# EAGLE design DownLink.ver1 (EAGLE 9.6.2)
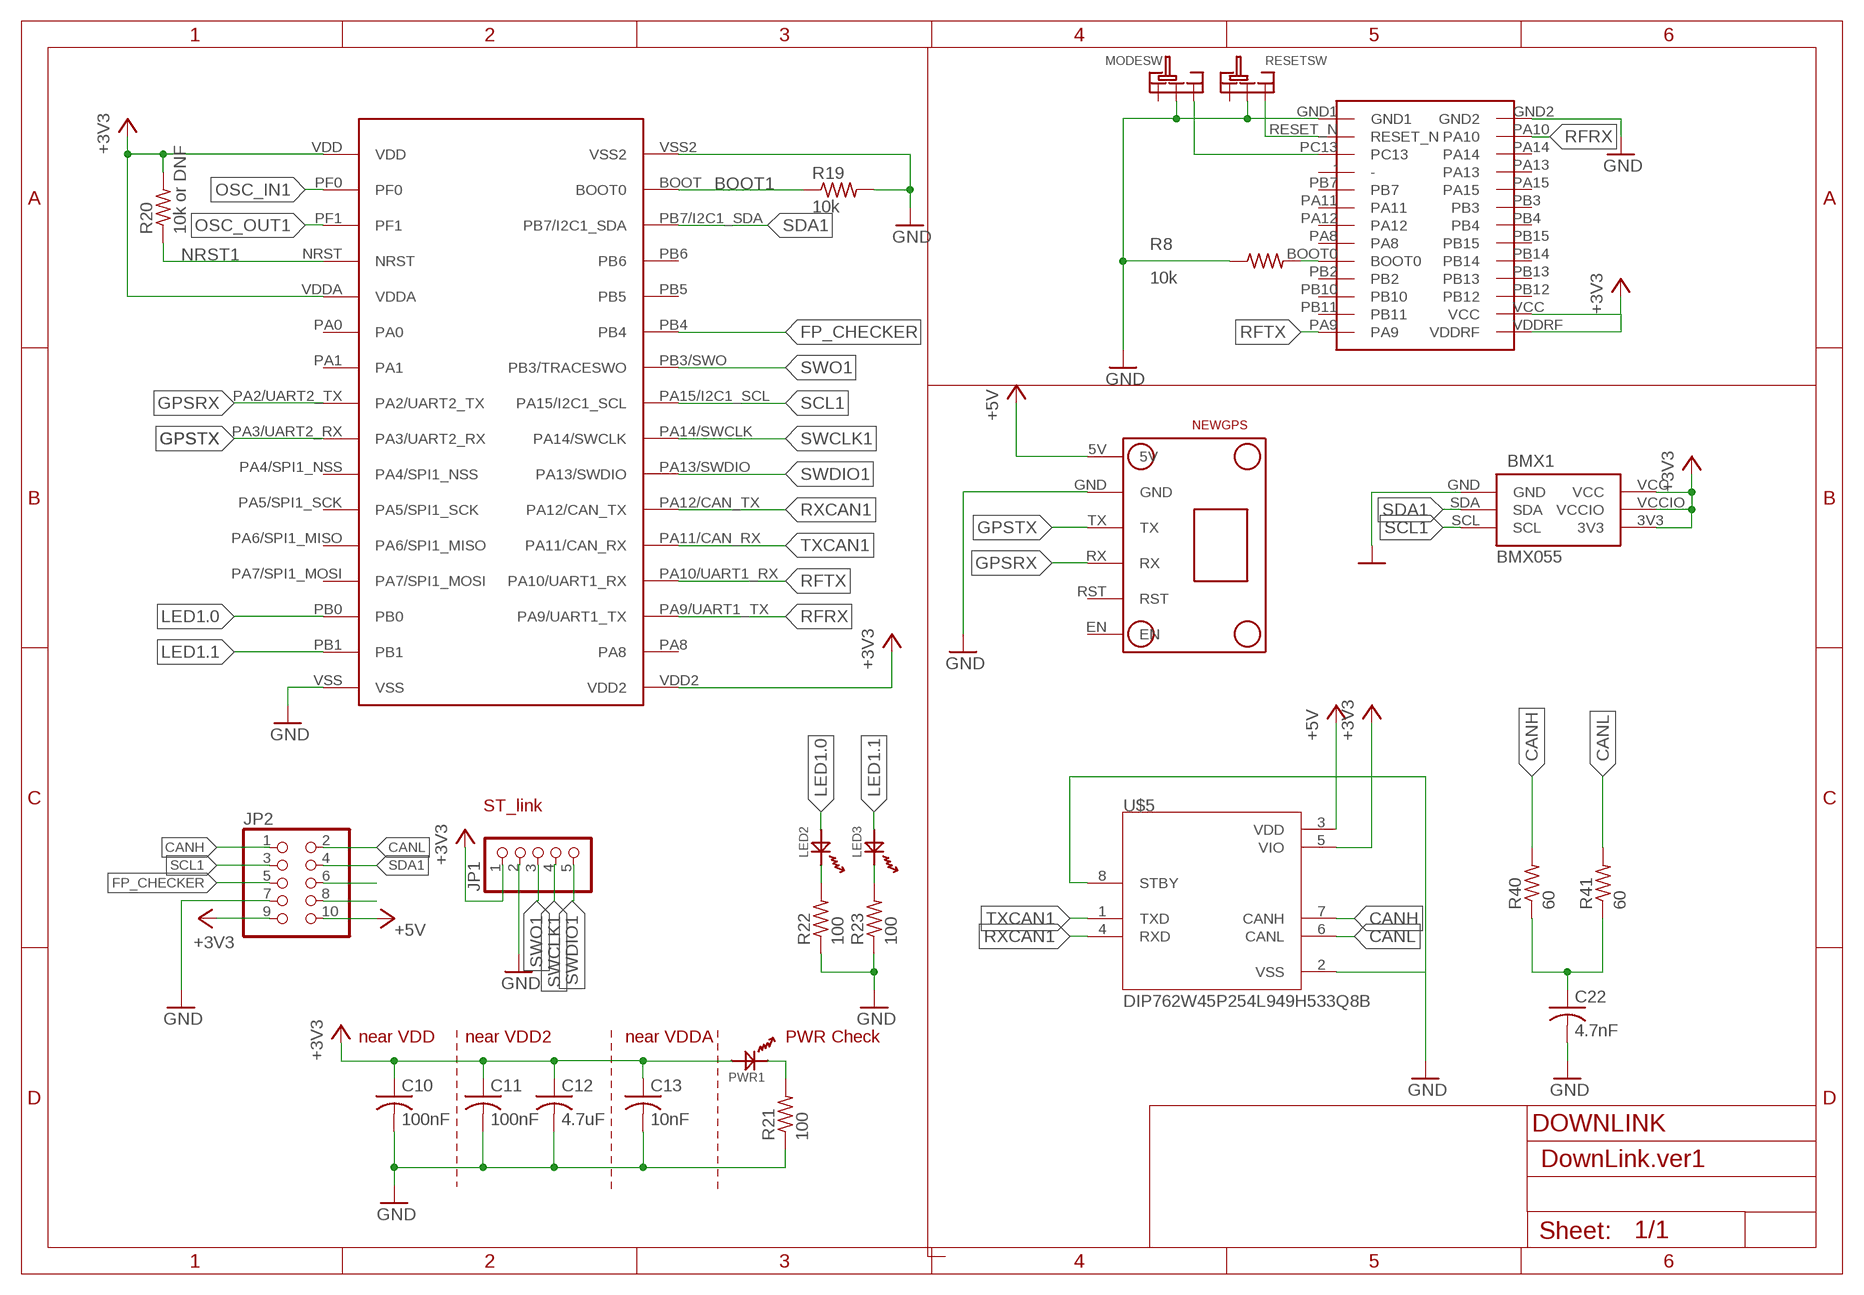
[diagram p0: schematic, sheet 1]

## Parts
BMX1  BMX055  [BMX055]
C10  100nF  C-USC1608  [C1608]
C11  100nF  C-USC1608  [C1608]
C12  4.7uF  C-USC1608  [C1608]
C13  10nF  C-USC1608  [C1608]
C22  4.7nF  C-USC0603  [C0603]
JP1  PINHD-1X5/90  [1X05/90]
JP2  PINHD-2X5/90  [2X05/90]
LED2  OSXX1608C1A  [OSXX1608C1A]
LED3  OSXX1608C1A  [OSXX1608C1A]
MODESW  SRIDE_SWITCH  [SRIDE_SWITCH]
PWR1  OSXX1608C1A  [OSXX1608C1A]
R8  10k  R-US_R0603  [R0603]
R19  10k  R-US_R0603  [R0603]
R20  10k or DNF  R-US_R0603  [R0603]
R21  100  R-US_R0603  [R0603]
R22  100  R-US_R0603  [R0603]
R23  100  R-US_R0603  [R0603]
R40  60  R-US_R0603  [R0603]
R41  60  R-US_R0603  [R0603]
RESETSW  SRIDE_SWITCH  [SRIDE_SWITCH]
STM1  STM32F303K8  [STM32F303K8]
U$1  NEWGPS  [NEWGPS]
U$3  RM-92A  [RM-92A]
U$5  DIP762W45P254L949H533Q8B  [DIP762W45P254L949H533Q8B]

## Nets
+3V3: BMX1.3V3 BMX1.VCC BMX1.VCCIO C10.1 C11.1 C12.1 C13.1 JP1.1 JP2.9 PWR1.AN R20.2 STM1.VDD STM1.VDD2 STM1.VDDA U$3.VCC U$3.VDDRF U$5.5(VIO)
+5V: JP2.10 U$1.5V U$5.3(VDD)
BOOT1: R19.1 STM1.BOOT(BOOT0)
CANH: JP2.1 R40.2 U$5.7(CANH)
CANL: JP2.2 R41.2 U$5.6(CANL)
FP_CHECKER: JP2.5 STM1.PB4
GND [im]: BMX1.GND C10.2 C11.2 C12.2 C13.2 C22.2 JP1.2 JP2.7 MODESW.LR R8.1 R19.2 R21.1 R22.1 R23.1 RESETSW.LR STM1.VSS STM1.VSS2 U$1.GND U$3.GND1 U$3.GND2 U$5.2(VSS) U$5.8(STBY)
GPSRX: STM1.PA2/UART2_TX U$1.RX
GPSTX: STM1.PA3/UART2_RX U$1.TX
LED1.0: LED2.AN STM1.PB0
LED1.1: LED3.AN STM1.PB1
N$5: MODESW.R U$3.PC13
N$6: RESETSW.R U$3.RESET_N
N$8: JP2.6
N$10: R8.2 U$3.BOOT0
N$11: JP2.8
N$15: PWR1.CT R21.2
N$16: LED2.CT R22.2
N$17: LED3.CT R23.2
N$22: C22.1 R40.1 R41.1
NRST1: R20.1 STM1.NRST
OSC_IN1: STM1.PF0
OSC_OUT1: STM1.PF1
RFRX: STM1.PA9/UART1_TX U$3.PA10
RFTX: STM1.PA10/UART1_RX U$3.PA9
RXCAN1: STM1.PA12/CAN_TX U$5.4(RXD)
SCL1: BMX1.SCL JP2.3 STM1.PA15/I2C1_SCL
SDA1: BMX1.SDA JP2.4 STM1.PB7/I2C1_SDA
SWCLK1: JP1.4 STM1.PA14/SWCLK
SWDIO1: JP1.5 STM1.PA13/SWDIO
SWO1: JP1.3 STM1.PB3/SWO(PB3/TRACESWO)
TXCAN1: STM1.PA11/CAN_RX U$5.1(TXD)
Unconnected: MODESW.L RESETSW.L STM1.PA0 STM1.PA1 STM1.PA4/SPI1_NSS STM1.PA5/SPI1_SCK STM1.PA6/SPI1_MISO STM1.PA7/SPI1_MOSI STM1.PA8 STM1.PB5 STM1.PB6 U$1.EN U$1.RST U$3.- U$3.PA8 U$3.PA11 U$3.PA12 U$3.PA13 U$3.PA14 U$3.PA15 U$3.PB2 U$3.PB3 U$3.PB4 U$3.PB7 U$3.PB10 U$3.PB11 U$3.PB12 U$3.PB13 U$3.PB14 U$3.PB15

## Notes on the sheet
- ST_link
- near VDD | near VDD2 | near VDDA | PWR Check
- DOWNLINK

## Library data of the parts
BMX1 = BMX055:BMX055
C10-C13 C22 = rcl:C-US: CAPACITOR, American symbol; SPICEPREFIX: C
JP1 = pinhead:PINHD-1X5: PIN HEADER
JP2 = pinhead:PINHD-2X5: PIN HEADER
LED2 LED3 PWR1 = Chip LED:OSXX1608C1A
MODESW RESETSW = Sride Switch:SRIDE_SWITCH
R8 R19-R23 R40 R41 = rcl:R-US_: RESISTOR, American symbol; SPICEPREFIX: R
STM1 = STM32F303K8:STM32F303K8
U$1 = New_GPS:NEWGPS
U$3 = RM-92A:RM-92A
U$5 = MCP2562-E_P:DIP762W45P254L949H533Q8B

## Net classes
0 default: width 0.279 mm

## Board
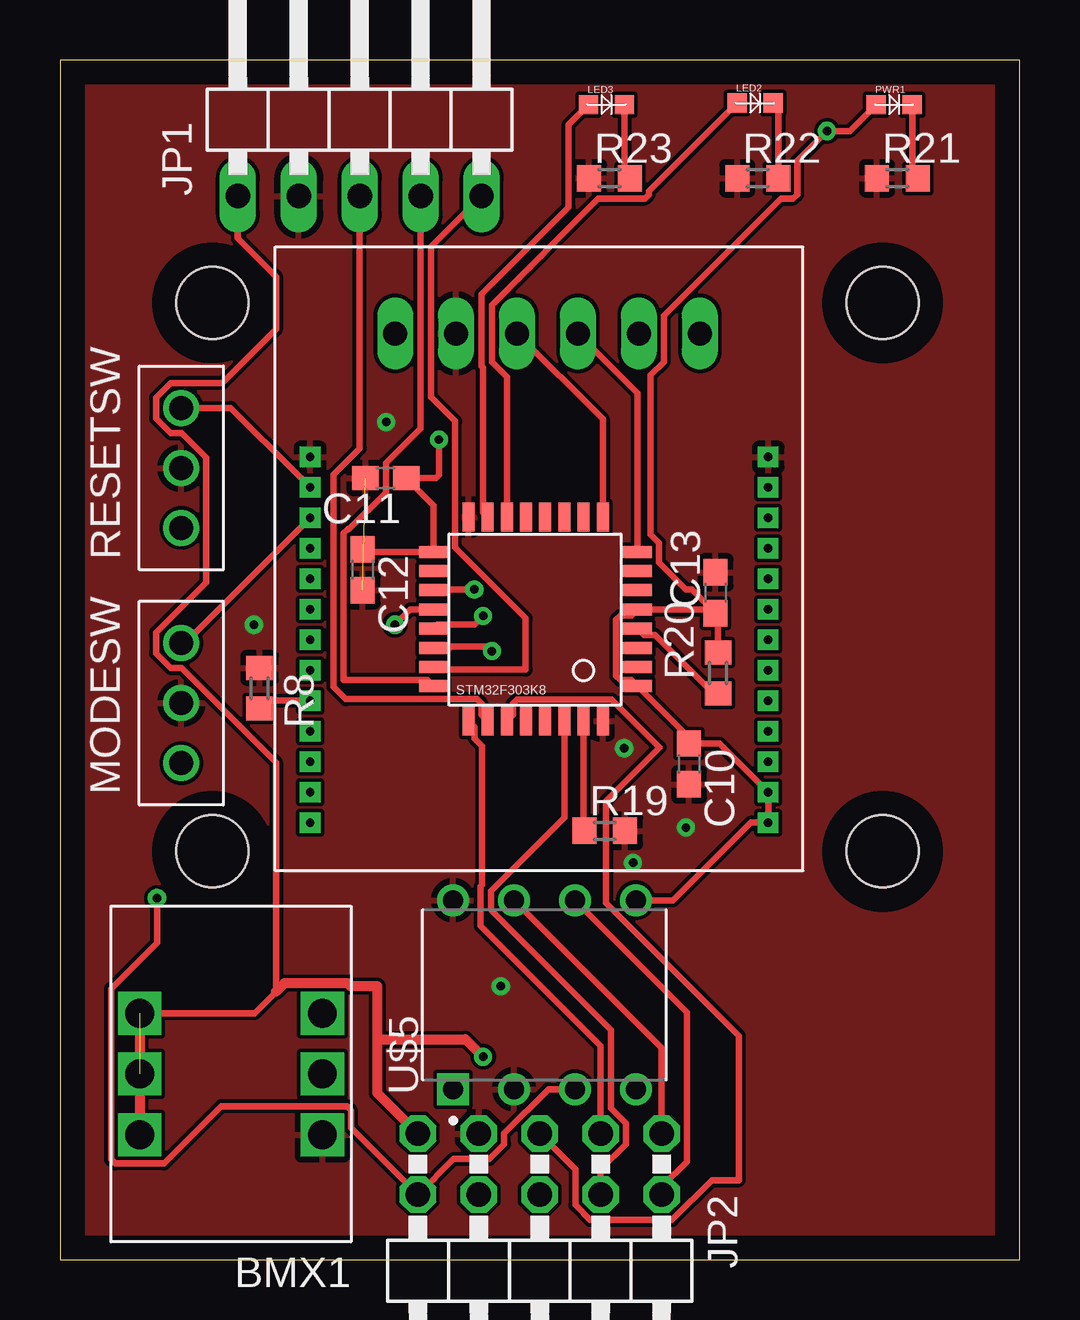
[diagram p1: board, top side]
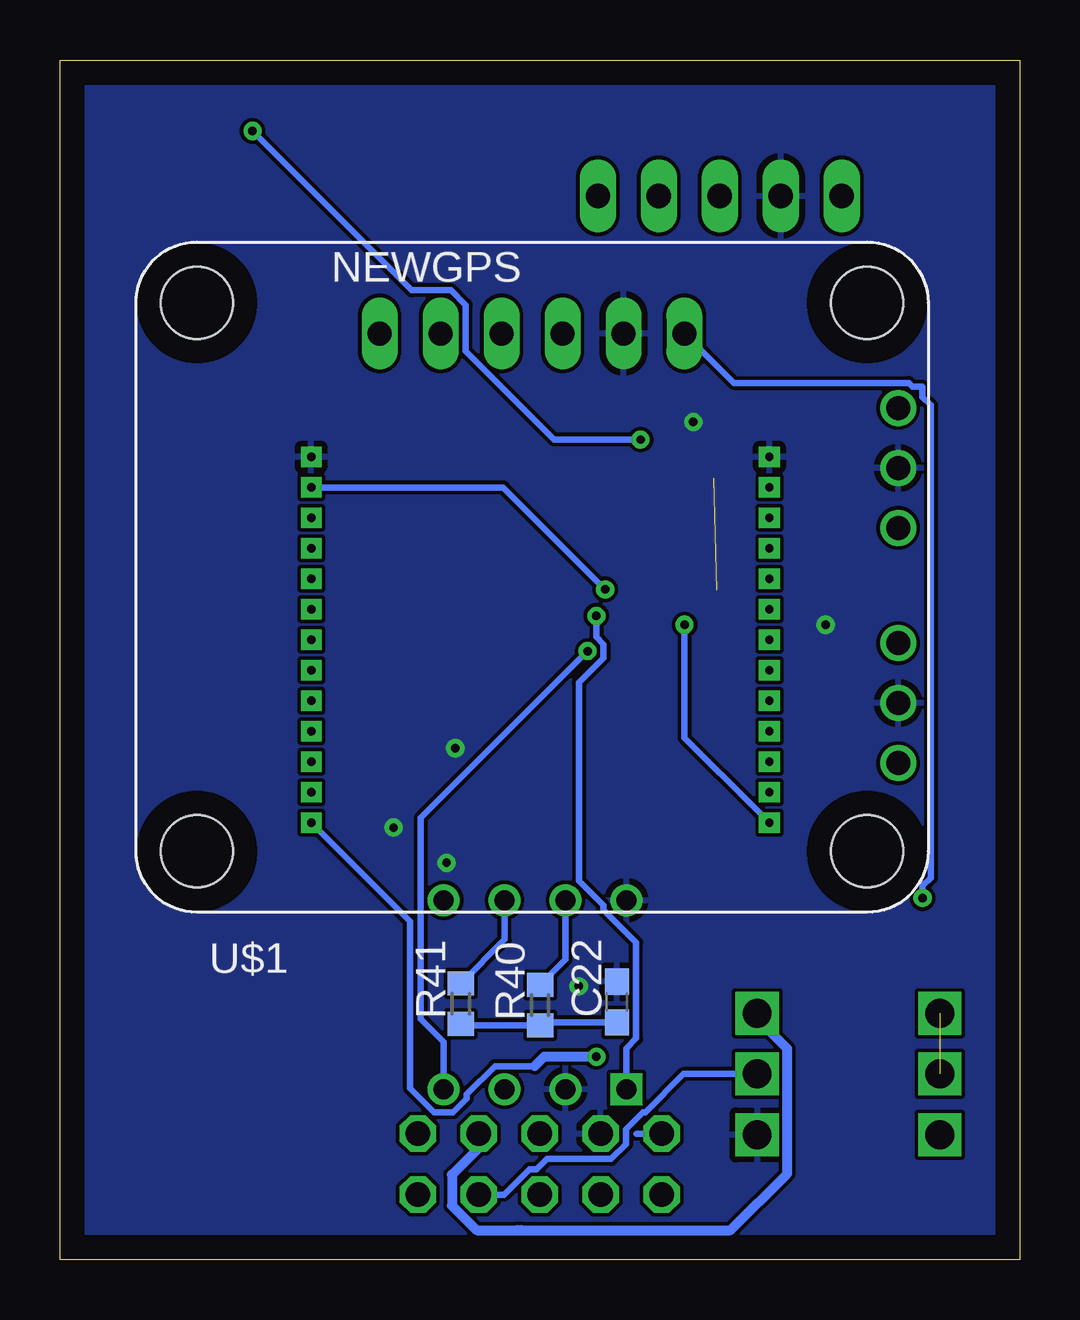
[diagram p2: board, bottom side, seen from below]

Size 40 x 50 mm. Coordinates in mm from the lower left corner, seen from the top.
Outline: 0,0 40,0 40,50 0,50 0,0
Copper layers (1*16): Top 0.035mm / dielectric 1.5mm / Bottom 0.035mm
Design rules "default": minimum track width 6mil, minimum drill 0.35mm, track to track 6mil, track to pad 6mil, pad to pad 6mil, via to via 6mil, smd to smd 6mil, copper to edge 40mil, drill to drill 6mil, minimum pad ring 10mil, minimum via ring 8mil, stop-mask expansion 4mil, vias tented up to drill 0mil, thermal gap 10mil

### Footprints (pad centres in the part's own frame; a part is rotated, then mirrored left to right if it is on the bottom)
BMX055 = drill 1.2 pad 1.5 square: 3V3 8.81,-9.53; GND 1.19,-4.46; SCL 1.19,-9.53; SDA 1.19,-7; VCC 8.81,-4.46; VCCIO 8.81,-7
C1608 = smd 1.1 x 1: 1 -0.85,0; 2 0.85,0
C0603 = smd 1.1 x 1: 1 -0.85,0; 2 0.85,0
1X05/90 = drill 1.016 long: 1 -5.08,-3.81; 2 -2.54,-3.81; 3 0,-3.81; 4 2.54,-3.81; 5 5.08,-3.81
2X05/90 = drill 1.016 octagon: 1 -5.08,-6.35; 2 -5.08,-3.81; 3 -2.54,-6.35; 4 -2.54,-3.81; 5 0,-6.35; 6 0,-3.81; 7 2.54,-6.35; 8 2.54,-3.81; 9 5.08,-6.35; 10 5.08,-3.81
OSXX1608C1A = smd 0.8 x 0.8: AN -0.75,0; CT 0.75,0
SRIDE_SWITCH = drill 1: L -2.5,0; LR 0,0; R 2.5,0
R0603 = smd 1 x 1.1: 1 -0.85,0; 2 0.85,0
STM32F303K8 = smd 0.5 x 1.2: BOOT 1.6,8.5; PA3/UART2_RX 0.8,0; PA4/SPI1_NSS 1.6,0; PA5/SPI1_SCK 2.4,0; PA6/SPI1_MISO 3.2,0; PA7/SPI1_MOSI 4,0; PA15/I2C1_SCL 6.4,8.5; PB0 4.8,0; PB1 5.6,0; PB3/SWO 5.6,8.5; PB4 4.8,8.5; PB5 4,8.5; PB6 3.2,8.5; PB7/I2C1_SDA 2.4,8.5; VSS 0.8,8.5; VSS2 6.4,0 | smd 1.2 x 0.5: NRST -0.65,4.65; PA0 -0.65,3.05; PA1 -0.65,2.25; PA2/UART2_TX -0.65,1.45; PA8 7.85,2.25; PA9/UART1_TX 7.85,3.05; PA10/UART1_RX 7.85,3.85; PA11/CAN_RX 7.85,4.65; PA12/CAN_TX 7.85,5.45; PA13/SWDIO 7.85,6.25; PA14/SWCLK 7.85,7.05; PF0 -0.65,6.25; PF1 -0.65,5.45; VDD -0.65,7.05; VDD2 7.85,1.45; VDDA -0.65,3.85
NEWGPS = drill 1 long: 5V 10.16,-24.13; EN 22.86,-24.13; GND 12.7,-24.13; RST 20.32,-24.13; RX 17.78,-24.13; TX 15.24,-24.13 | hole 3: 2.54,-2.54; 30.48,-2.54; 30.48,-25.4; 2.54,-25.4
RM-92A = drill 0.35 square: - 0,11.43; BOOT0 0,5.08; GND1 0,15.24; GND2 19.1,15.24; PA8 0,6.35; PA9 0,0; PA10 19.1,13.97; PA11 0,8.89; PA12 0,7.62; PA13 19.1,11.43; PA14 19.1,12.7; PA15 19.1,10.16; PB2 0,3.81; PB3 19.1,8.89; PB4 19.1,7.62; PB7 0,10.16; PB10 0,2.54; PB11 0,1.27; PB12 19.1,2.54; PB13 19.1,3.81; PB14 19.1,5.08; PB15 19.1,6.35; PC13 0,12.7; RESET_N 0,13.97; VCC 19.1,1.27; VDDRF 19.1,0
DIP762W45P254L949H533Q8B = drill 0.83 square: 1 -3.937,3.81 | drill 0.83: 2 -3.937,1.27; 3 -3.937,-1.27; 4 -3.937,-3.81; 5 3.937,-3.81; 6 3.937,-1.27; 7 3.937,1.27; 8 3.937,3.81

### Placement (x,y rotation side)
BMX1  12.13,0.73 180 top
C10  26.22,20.66 270 top
C11  13.58,32.58 180 top
C12  12.62,28.75 270 top
C13  27.33,27.79 90 top
C22  16.78,10.73 90 bottom
JP1  12.49,48.14 0 top
JP2  20,-1.1 180 top
LED2  28.98,48.2 0 top
LED3  22.78,48.14 0 top
MODESW  5.05,23.2 90 top
PWR1  34.77,48.14 0 top
R8  8.31,23.81 270 top
R19  22.71,17.87 0 top
R20  27.43,24.45 90 top
R21  34.9,45.06 0 top
R22  29.09,45.06 0 top
R23  22.91,45.06 0 top
R40  19.98,10.61 90 bottom
R41  23.29,10.67 90 bottom
RESETSW  5.05,32.99 90 top
STM1  23.43,30.95 180 top
U$1  3.81,14.47 180 bottom
U$3  10.43,18.21 0 top
U$5  20.2,11.04 90 top

### Tracks (layer width: path | path; a pad name or v marks a point on that pad's centre or on a via)
+3V3  (via drill 0.35)  (1 unrouted)
  Top 0.279: C13.1 27.18,27.1 STM1.VDDA 23.82,26.84 23.36,26.84 23.18,26.67 23.18,24.33 23.36,24.16 23.82,24.16 STM1.VDD 26.22,21.75 C10.1 27.5,21.51 28.98,20.03 U$3.VCC U$3.VDDRF 28.79,18.21 25.55,14.97 U$5.5 | C13.1 27.43,26.84 R20.2 | C12.1 12.72,29.5 STM1.VDD2 15.58,31.43 C11.1 15.68,32.58 15.8,32.71 v15.8,34.17 v15.8,34.18 | JP1.1 7.42,42.56 9.01,40.97 9.01,38.77 6.77,36.54 4.62,36.54 4.01,35.92 4.01,35.06 4.62,34.44 5.08,34.44 6.1,33.42 6.1,28.22 4.01,26.13 4.01,25.26 4.62,24.65 5.08,24.65 9.01,20.73 9.01,11.16 8.11,10.27 BMX1.3V3 | PWR1.AN 32.92,47.04 v31.97,47.04 30.73,45.8 30.73,44.39 30.56,44.22 30.06,44.22 25.18,39.34 25.18,37.41 24.62,36.86 24.62,30.22 24.97,29.87 24.97,29.05 26.09,27.93 26.34,27.93 C13.1
  Top 0.406: JP2.9 13.23,6.94 13.23,9.19 | 13.23,9.19 13.23,11.39 12.11,11.39 11.98,11.52 9.36,11.52 9.01,11.16 | BMX1.3V3 BMX1.VCC | 13.23,9.19 16.91,9.19 v17.64,8.45
  Bottom 0.279: JP2.9 15.97,5.25 | U$3.VDDRF 25.4,14.09 25.4,7.13 24.41,6.14 23.61,6.14 23.05,6.7 23.05,6.88 21.87,8.06 20.21,8.06 | v31.97,47.04 25.34,40.4 23.7,40.4 23.08,39.79 23.08,37.86 19.4,34.18 v15.8,34.18
  Bottom 0.406: v17.64,8.45 19.82,8.45 20.21,8.06
+5V  (via drill 0.35)
  Top 0.279: U$5.3 20.36,7.1 18.51,5.25 18.51,4.81 17.9,4.19 16.41,4.19 JP2.10 12.13,5.5 12.13,6.22 11.96,6.39 6.72,6.39 4.34,4 2.3,4 2.12,4.17 2.12,11.29 4.04,13.2 v4.04,15.07
  Bottom 0.279: U$1.5V 11.9,36.54 4.62,36.54 4.47,36.38 4.04,36.38 4.04,35.96 3.69,35.61 3.69,15.91 4.04,15.56 v4.04,15.07
BOOT1
  Top 0.279: STM1.BOOT 21.83,17.9 R19.1
CANH
  Top 0.279: U$5.7 25.08,8.82 JP2.1
  Bottom 0.279: R40.2 18.93,12.51 U$5.7
CANL
  Top 0.279: JP2.2 25.08,3.02 26.13,4.08 26.13,10.31 U$5.6
  Bottom 0.279: R41.2 21.47,13.34 U$5.6
FP_CHECKER
  Top 0.279: STM1.PB4 18.89,22.7 18.89,23.17 19.06,23.34 23,23.34 24.99,21.34 22.77,19.12 22.77,14.86 28.3,9.32 28.3,3.31 27.17,3.31 25.52,1.65 22.1,1.65 21.49,2.27 21.49,3.76 JP2.5
GND  (via drill 0.35, 0.35 pad 0.55)  (1 unrouted)
  other vias: 23.89,16.54 18.38,11.39 13.6,34.91 8.09,26.46 23.52,21.32 26.09,18.01
  pour Top: 0.37,51.82 42.63,51.82 43.73,50.72 43.73,-5.14 43.37,-5.51 -4.41,-5.51 -4.78,-5.14 -4.78,50.72 -4.04,51.45 -3.67,51.82
  pour Bottom: -3.67,51.82 41.9,51.82 44.47,49.24 44.47,-4.78 41.16,-8.09 -1.84,-8.09 -4.04,-5.88 -4.04,51.45
GPSRX
  Top 0.279: U$1.RX 24.08,36.12 STM1.PA2/UART2_TX
GPSTX
  Top 0.279: U$1.TX 22.63,35.02 STM1.PA3/UART2_RX
LED1.0
  Top 0.279: LED2.AN 24.55,44.53 24.55,44.39 24.38,44.22 22.44,44.22 18,39.79 18,37.41 18.63,36.79 STM1.PB0
LED1.1
  Top 0.279: STM1.PB1 17.64,31.14 17.64,37.17 17.57,37.24 17.57,40.24 21.2,43.87 21.2,47.31 LED3.AN
N$5
  Top 0.279: U$3.PC13 9.88,30.36 5.21,25.7 MODESW.R
N$6
  Top 0.279: U$3.RESET_N 9.88,32.73 7.12,35.49 RESETSW.R
N$10
  Top 0.279: R8.2 8.65,23.29 U$3.BOOT0
N$15
  Top 0.279: PWR1.CT 35.52,45.3 R21.2
N$16
  Top 0.279: LED2.CT 29.94,47.99 R22.2
N$17
  Top 0.279: LED3.CT 23.53,45.29 R23.2
N$22
  Bottom 0.279: C22.1 19.85,9.88 R40.1 23.23,9.76 R41.1
NRST1
  Top 0.279: STM1.NRST 24.34,26.04 24.8,26.04 27.24,23.59 R20.1
RFRX  (via drill 0.35)
  Top 0.279: STM1.PA9/UART1_TX 15.61,27.93 v17.27,27.93
  Bottom 0.279: v17.27,27.93 21.52,32.18 U$3.PA10
RFTX  (via drill 0.35)
  Top 0.279: STM1.PA10/UART1_RX 14.6,27.1 v13.96,26.46
  Bottom 0.279: U$3.PA9 10.98,18.76 13.96,21.75 v13.96,26.46
RXCAN1  (via drill 0.35)
  Top 0.279: STM1.PA12/CAN_TX 16.23,25.5 16.29,25.56 17.81,25.56 v18.01,25.36
  Bottom 0.279: U$5.4 24.01,9.07 24.97,10.04 24.97,18.4 v18.01,25.36
SCL1
  Top 0.279: STM1.PA15/I2C1_SCL 17.29,22.19 17.29,21.73 17.6,21.41 17.6,15.62 17.54,15.55 17.54,13.91 22.54,8.9 JP2.3
  Bottom 0.406: JP2.3 22.54,4.66 23.66,3.54 23.66,2.25 22.63,1.22 20.95,1.22 20.76,1.22 12.04,1.22 9.68,3.58 9.68,8.78 10.94,10.04 BMX1.SCL
SDA1
  Top 0.279: JP2.4 22.54,3.76 23.59,4.81 23.59,5.68 22.97,6.31 22.97,9.57 17.97,14.58 17.97,15.37 21.03,18.43 STM1.PB7/I2C1_SDA
  Bottom 0.279: BMX1.SDA 14,7.74 15.6,6.14 15.69,6.14 16.41,5.42 16.41,4.81 17.02,4.19 19.69,4.19 20.13,3.76 20.44,3.76 21.49,2.71 JP2.4
SWCLK1
  Top 0.279: JP1.4 15.04,42.4 15.03,42.4 15.03,34.65 13.59,33.2 13.59,31.98 12.05,30.44 12,30.44 11.83,30.27 11.83,24.16 15.32,24.16 STM1.PA14/SWCLK
SWDIO1
  Top 0.279: JP1.5 15.46,42.22 15.46,35.95 16.47,34.94 16.47,29.68 19.41,26.74 19.41,24.59 15.69,24.59 STM1.PA13/SWDIO
SWO1
  Top 0.279: STM1.PB3/SWO 17.57,22.7 17.57,23.17 17.38,23.36 11.92,23.36 11.4,23.87 11.4,32.71 12.49,33.81 JP1.3
TXCAN1  (via drill 0.35)
  Top 0.279: STM1.PA11/CAN_RX 15.74,26.46 17.27,26.46 v17.64,26.83
  Bottom 0.279: v17.64,26.83 17.64,25.94 17.34,25.64 17.34,25.08 18.38,24.04 18.38,15.78 17.35,14.76 17.35,14.58 15.98,13.21 15.98,9.21 16.39,8.81 U$5.1